# EAGLE design interface_lcd V2006_1 (EAGLE 4.09)
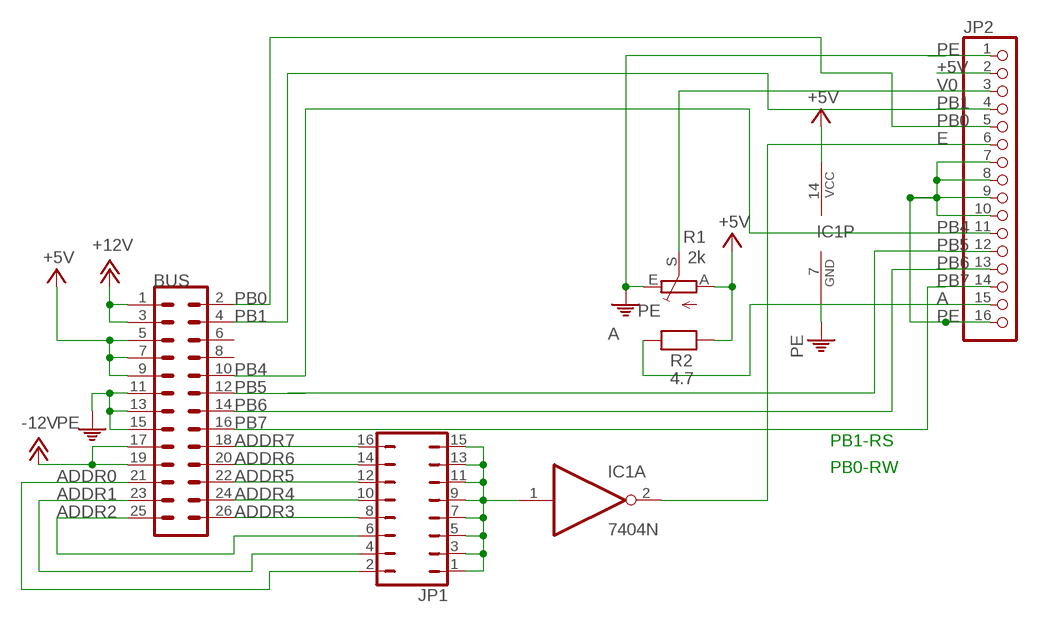
[diagram p0: schematic, sheet 1]

## Parts
BUS  ML26  [ML26]
IC1  7404N  [DIL14]
JP1  JP8Q  [JP8Q]
JP2  PINHD-1X16  [1X16]
R1  2k  TRIM_EU-S64W  [S64W]
R2  4.7  RESEU-10  [R-10]

## Nets
+5V: BUS.5 BUS.7 BUS.9 IC1.14(P:VCC) JP2.2 R1.A R2.2
+12V: BUS.1 BUS.3
-12V: BUS.17 BUS.19
A: JP2.15 R2.1
ADDR0: BUS.21 JP1.2
ADDR1: BUS.23 JP1.4
ADDR2: BUS.25 JP1.6
ADDR3: BUS.26 JP1.8
ADDR4: BUS.24 JP1.10
ADDR5: BUS.22 JP1.12
ADDR6: BUS.20 JP1.14
ADDR7: BUS.18 JP1.16
E: IC1.2(A:O) JP2.6
N$1: IC1.1(A:I) JP1.1 JP1.3 JP1.5 JP1.7 JP1.9 JP1.11 JP1.13 JP1.15
PB0: BUS.2 JP2.5
PB1: BUS.4 JP2.4
PB4: BUS.10 JP2.11
PB5: BUS.12 JP2.12
PB6: BUS.14 JP2.13
PB7: BUS.16 JP2.14
PE: BUS.11 BUS.13 BUS.15 IC1.7(P:GND) JP2.1 JP2.7 JP2.8 JP2.9 JP2.10 JP2.16 R1.E
V0: JP2.3 R1.S
Unconnected: BUS.6 BUS.8 IC1.3(B:I) IC1.4(B:O) IC1.5(C:I) IC1.6(C:O) IC1.8(D:O) IC1.9(D:I) IC1.10(E:O) IC1.11(E:I) IC1.12(F:O) IC1.13(F:I)

## Notes on the sheet
- PB1-RS
- PB0-RW

## Library data of the parts
BUS = con-harting-ml:ML26: HARTING
IC1 = 74xx-us:74*04: Hex INVERTER
JP1 = jumper:JP8Q: JUMPER
JP2 = pinhead:PINHD-1X16: PIN HEADER
R1 = pot:TRIM_EU-: POTENTIOMETER
R2 = discrete:RESEU-10

## Board
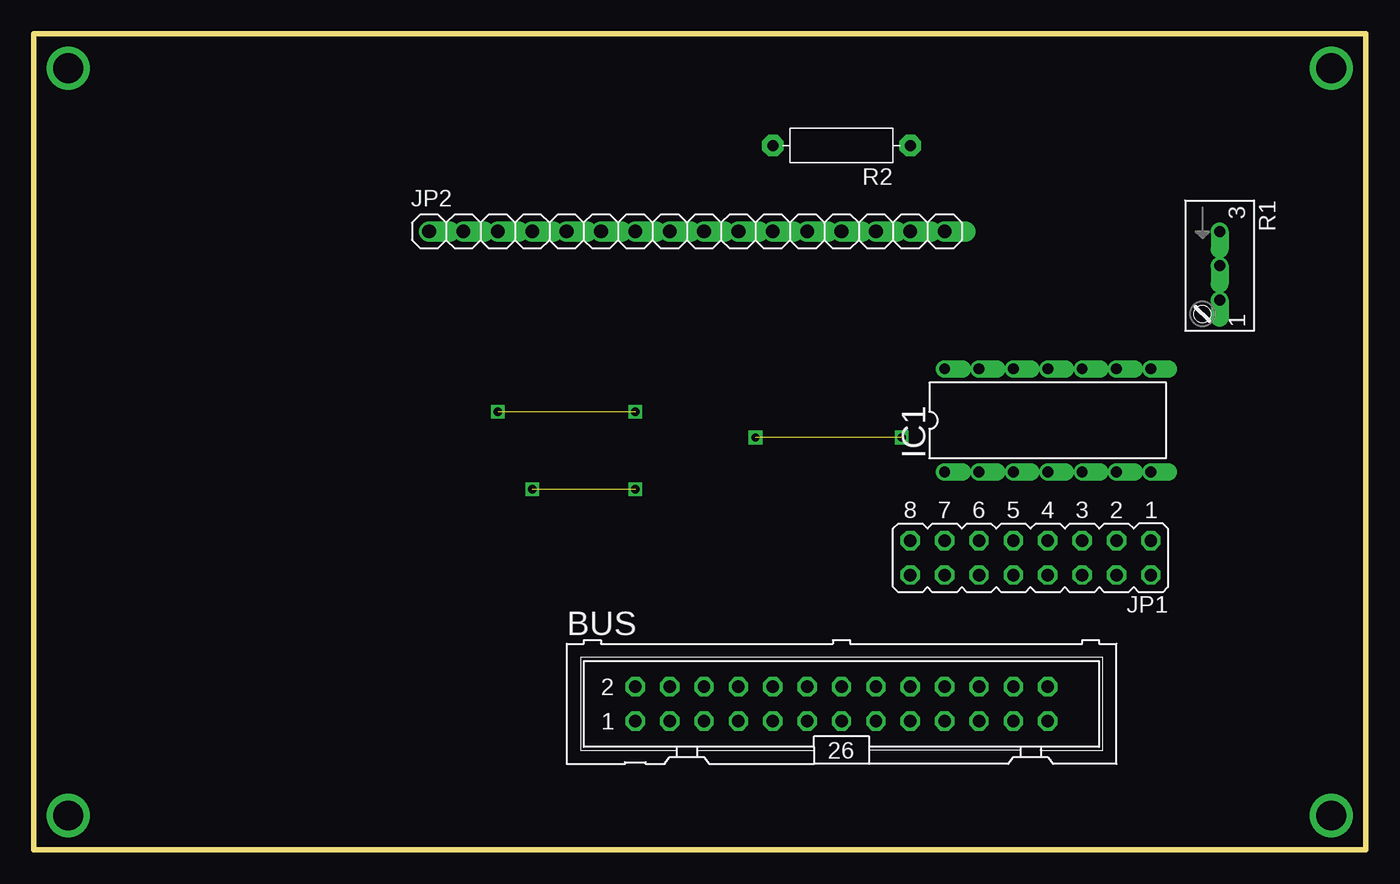
[diagram p1: board, top side]
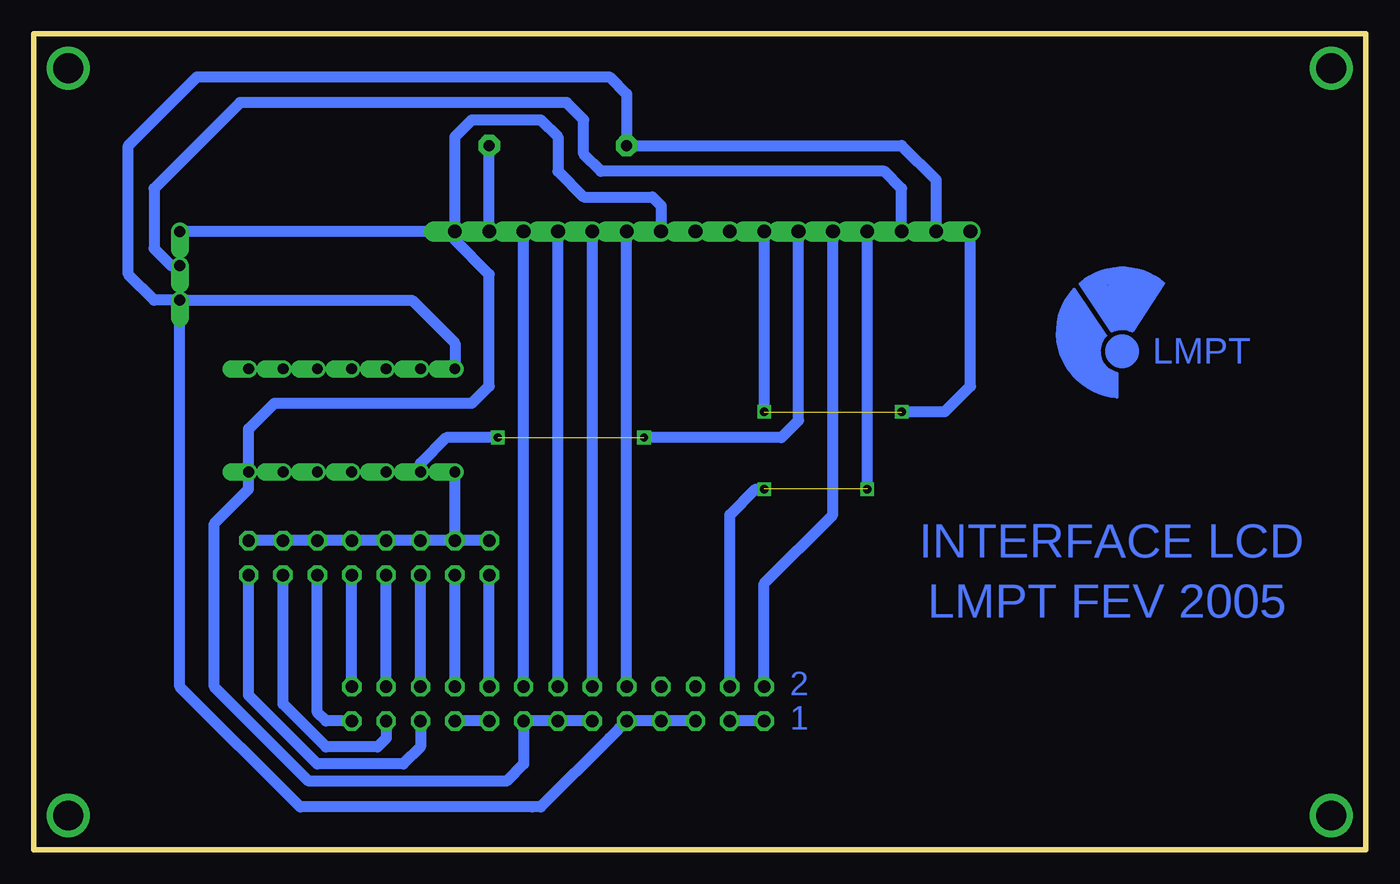
[diagram p2: board, bottom side, seen from below]

Size 98.42 x 60.33 mm. Coordinates in mm from the lower left corner, seen from the top.
Outline: 0,0 0,60.33 98.42,60.33 98.42,0 0,0
Copper layers used: Bottom

### Footprints (pad centres in the part's own frame; a part is rotated, then mirrored left to right if it is on the bottom)
ML26 = drill 0.914 octagon: 1 -15.24,-1.27; 2 -15.24,1.27; 3 -12.7,-1.27; 4 -12.7,1.27; 5 -10.16,-1.27; 6 -10.16,1.27; 7 -7.62,-1.27; 8 -7.62,1.27; 9 -5.08,-1.27; 10 -5.08,1.27; 11 -2.54,-1.27; 12 -2.54,1.27; 13 0,-1.27; 14 0,1.27; 15 2.54,-1.27; 16 2.54,1.27; 17 5.08,-1.27; 18 5.08,1.27; 19 7.62,-1.27; 20 7.62,1.27; 21 10.16,-1.27; 22 10.16,1.27; 23 12.7,-1.27; 24 12.7,1.27; 25 15.24,-1.27; 26 15.24,1.27
DIL14 = drill 0.8 offset: 1 -7.62,-3.81; 2 -5.08,-3.81; 3 -2.54,-3.81; 4 0,-3.81; 5 2.54,-3.81; 6 5.08,-3.81; 7 7.62,-3.81; 8 7.62,3.81; 9 5.08,3.81; 10 2.54,3.81; 11 0,3.81; 12 -2.54,3.81; 13 -5.08,3.81; 14 -7.62,3.81
JP8Q = drill 0.914 octagon: 1 -8.89,-1.27; 2 -8.89,1.27; 3 -6.35,-1.27; 4 -6.35,1.27; 5 -3.81,-1.27; 6 -3.81,1.27; 7 -1.27,-1.27; 8 -1.27,1.27; 9 1.27,-1.27; 10 1.27,1.27; 11 3.81,-1.27; 12 3.81,1.27; 13 6.35,-1.27; 14 6.35,1.27; 15 8.89,-1.27; 16 8.89,1.27
1X16 = drill 1.016 offset: 1 -19.05,0; 2 -16.51,0; 3 -13.97,0; 4 -11.43,0; 5 -8.89,0; 6 -6.35,0; 7 -3.81,0; 8 -1.27,0; 9 1.27,0; 10 3.81,0; 11 6.35,0; 12 8.89,0; 13 11.43,0; 14 13.97,0; 15 16.51,0; 16 19.05,0
S64W = drill 0.813 offset: A 2.54,1.27; E -2.54,1.27; S 0,1.27
R-10 = drill 0.813 pad 1.6 octagon: 1 -5.08,0; 2 5.08,0

### Placement (x,y rotation side)
BUS  59.69,10.79 0 top
IC1  74.93,31.75 0 top
JP1  73.66,21.59 180 top
JP2  48.26,45.72 0 top
R1  86.36,43.18 270 top
R2  59.69,52.07 180 top

### Tracks (layer width: path | path; a pad name or v marks a point on that pad's centre or on a via)
+5V
  Bottom 0.813: JP2.2 31.75,49.53 34.29,52.07 R2.2 54.61,55.88 55.88,57.15 86.36,57.15 91.44,52.07 91.44,42.55 89.53,40.64 R1.A | IC1.14 67.31,37.47 70.48,40.64 R1.A | BUS.5 BUS.7 BUS.9 55.88,8.26 | 55.88,8.26 56.52,7.62 | R1.A 87.63,12.06 78.74,3.17 61.59,3.17 60.96,3.17 55.88,8.26
+12V
  Bottom 0.813: BUS.1 BUS.3
-12V
  Bottom 0.813: BUS.17 BUS.19
A
  Bottom 0.813: JP2.15 R2.1
ADDR0
  Bottom 0.813: JP1.2 82.55,11.43 77.47,6.35 71.12,6.35 69.85,7.62 BUS.21
ADDR1
  Bottom 0.813: JP1.4 80.01,10.79 76.83,7.62 73.03,7.62 72.39,8.26 BUS.23
ADDR2
  Bottom 0.813: JP1.6 77.47,10.16 76.83,9.53 BUS.25
ADDR3
  Bottom 0.813: BUS.26 JP1.8
ADDR4
  Bottom 0.813: BUS.24 JP1.10
ADDR5
  Bottom 0.813: BUS.22 JP1.12
ADDR6
  Bottom 0.813: BUS.20 JP1.14
ADDR7
  Bottom 0.813: BUS.18 JP1.16
E  (via drill 0.61)  (1 unrouted)
  Bottom 0.813: JP2.6 41.91,31.75 43.18,30.48 v53.34,30.48 | IC1.2 69.85,28.57 67.94,30.48 v64.14,30.48
N$1
  Bottom 0.813: JP1.15 JP1.13 | JP1.1 JP1.3 JP1.5 | JP1.5 76.83,22.86 | JP1.5 JP1.7 JP1.9 JP1.11 JP1.13 | JP1.13 IC1.1
N$5
  Bottom 0.61: 20.67,41.81 18.66,38.71 18.06,38.93 20.27,42.07 19.15,42.53 17.47,42.76 16.32,42.47 15.33,41.81 17.41,38.8 17.79,38.83 19.59,42.05 17.4,42.37 15.82,41.59 17.68,39 18.88,42.07 16.21,41.4 17.57,39.66 18.27,41.85 16.7,41.18 17.51,40.39 17.59,41.34 17.43,42.41
N$7
  Bottom 0.61: 21.6,40.95 22.43,39.23 22.48,37.88 22.18,36.6 21.75,35.74 20.89,34.91 19.85,34.15 18.62,33.8 18.76,35.01 19.8,35.84 20,37.01 19.88,37.51 19.62,38.05 21.34,40.58 21.79,39.8 21.46,39.77 20.07,37.75 20.3,37.29 21.99,39.57 21.98,36.57 19.84,34.35 18.89,34.49 19.57,35.25 19.74,34.69 20.14,35.61 20.84,35.76 20.17,36.23 21.27,36.19 20.23,36.88 21.68,36.56 20.57,37.28 21.79,37.15 21,37.66 21.66,37.91 21.47,38.52
N$8
  Bottom 0.254: 18.38,33.48 18.38,35.21
N$10  (via drill 2.18 pad 2.54)
  other vias: 2.54,57.78
N$11
  Bottom 0.254: 19.25,38.03 21.53,41.44
N$12
  Bottom 0.254: 18.78,38.38 21.08,41.84
N$13
  Bottom 0.254: 14.98,41.86 17.25,38.38
N$14  (via drill 2.18 pad 2.54)
  other vias: 2.54,2.54
N$15  (via drill 2.18 pad 2.54)
  other vias: 95.89,57.78
N$16  (via drill 2.18 pad 2.54)
  other vias: 95.89,2.54
PB0
  Bottom 0.813: BUS.2 44.45,19.68 39.37,24.77 JP2.5
PB1  (via drill 0.61)  (1 unrouted)
  Bottom 0.813: BUS.4 46.99,22.86 | 46.99,22.86 46.99,23.5 | v36.83,26.67 JP2.4 | v44.45,26.67 45.09,26.67 46.99,24.77 46.99,22.86
PB4
  Bottom 0.813: BUS.10 JP2.11
PB5
  Bottom 0.813: BUS.12 JP2.12
PB6
  Bottom 0.813: BUS.14 JP2.13
PB7
  Bottom 0.813: BUS.16 JP2.14
PE  (via drill 0.61)  (1 unrouted)
  Bottom 0.813: BUS.11 BUS.13 BUS.15 62.23,6.35 63.5,5.08 78.11,5.08 85.09,12.06 85.09,24.13 82.55,26.67 IC1.7 82.55,31.11 80.64,33.02 66.04,33.02 64.77,34.29 64.77,42.55 67.31,45.09 JP2.16 | JP2.16 67.31,52.7 66.04,53.98 60.96,53.98 59.69,52.7 59.69,50.16 57.78,48.26 52.7,48.26 52.07,47.62 JP2.10 JP2.9 JP2.8 JP2.7 v44.45,32.38 | JP2.16 R1.E | JP2.1 29.21,34.29 31.11,32.38 v34.29,32.38
V0
  Bottom 0.813: JP2.3 34.29,48.9 35.56,50.16 56.52,50.16 57.78,51.44 57.78,53.98 59.05,55.24 83.19,55.24 89.53,48.9 89.53,44.45 88.27,43.18 R1.S
(copper drawn outside any net)
  Bottom 0.254: 18.38,35.21 arc125 19.16,38.11 | 17.16,38.31 arc-58 18.8,38.36 | 18.36,33.51 arc128 21.53,41.46 | 14.88,41.84 arc-82 21.11,41.84
  shapes: Bottom circle x2

### Text on the board
Bottom: LMPT | INTERFACE LCD | LMPT FEV 2005 | 2 | 1